# Altium schematic sheet [11]-MAIN_POWER.SchDoc
size A4
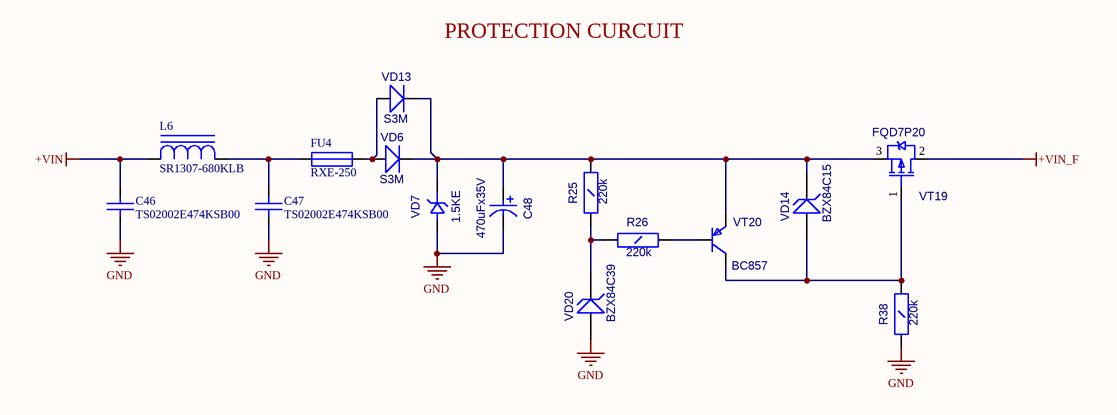
[diagram p0: [11]-MAIN_POWER.SchDoc]

## Parts
C46  TS02002E474KSB00  [CAP_ML_18x7x13]
C47  TS02002E474KSB00  [CAP_ML_18x7x13]
C48  470uFx35V  [CAP10x16_FLAT]
FU4  RXE-250  [RXE-250_FLAT]
L6  SR1307-680KLB  [SR1307]
R25  220k  [RC1206]
R26  220k  [RC1206]
R38  220k  [RC1206]
VD6  S3M  [SMC]
VD7  1.5KE  [DO-201]
VD13  S3M  [SMC]
VD14  BZX84C15  [SOT-23(123)]
VD20  BZX84C39  [SOT-23(123)]
VT19  FQD7P20  [D-PAK(TO-252AA)]
VT20  BC857  [SOT-23(123)]

## Nets
+VIN: C46.2(B) L6.1(C)
+VIN_F: VT19.2(D)
GND: C46.1(A) C47.1(A) C48.1 R38.1(A) VD7.1(A) VD20.1(A)
NetC47_2: C47.2(B) FU4.1 L6.2(A)
NetC48_2: C48.2 R25.2(B) VD6.2(K) VD7.2(K) VD13.2(K) VD14.3(K) VT19.3(S) VT20.2(E)
NetFU4_2: FU4.2 VD6.1(A) VD13.1(A)
NetR25_1: R25.1(A) R26.1(A) VD20.3(K)
NetR26_2: R26.2(B) VT20.1(B)
NetR38_2: R38.2(B) VD14.1(A) VT19.1(G) VT20.3(C)

## Notes on the sheet
- PROTECTION CURCUIT

## Library data of the parts
C46 C47 = CAP_HV_18x7x13: Value: TS02002E474KSB00
C48 = CAP_10mm: Radial capacitor; Value: 470uFx35V
L6 = SR1307: Power inductor; Value: SR1307-680KLB
R25 R26 R38 = RC1206: Value: 220k
VD6 VD13 = S3A: Schottky Rectifier; Value: S3M
VD14 VD20 = BZX84: Zener Voltage Regulator Diode
  VD14: Value: BZX84C15
  VD20: Value: BZX84C39
VT19 = IRFR9220: HEXFET Power MOSFET; OriginalName: IRLML5103; ComponentField7: Published 8-Jun-2000; Value: FQD7P20
VT20 = BC857B: PNP 100ma transistor; OriginalName: BC846BLT1; ComponentField7: Published 29-Sep-2000; Value: BC857
FU4 = RXE-250: Value: RXE-250
VD7 = 1.5KE: Value: *